# EAGLE design PR5006 (EAGLE 6.5.0)
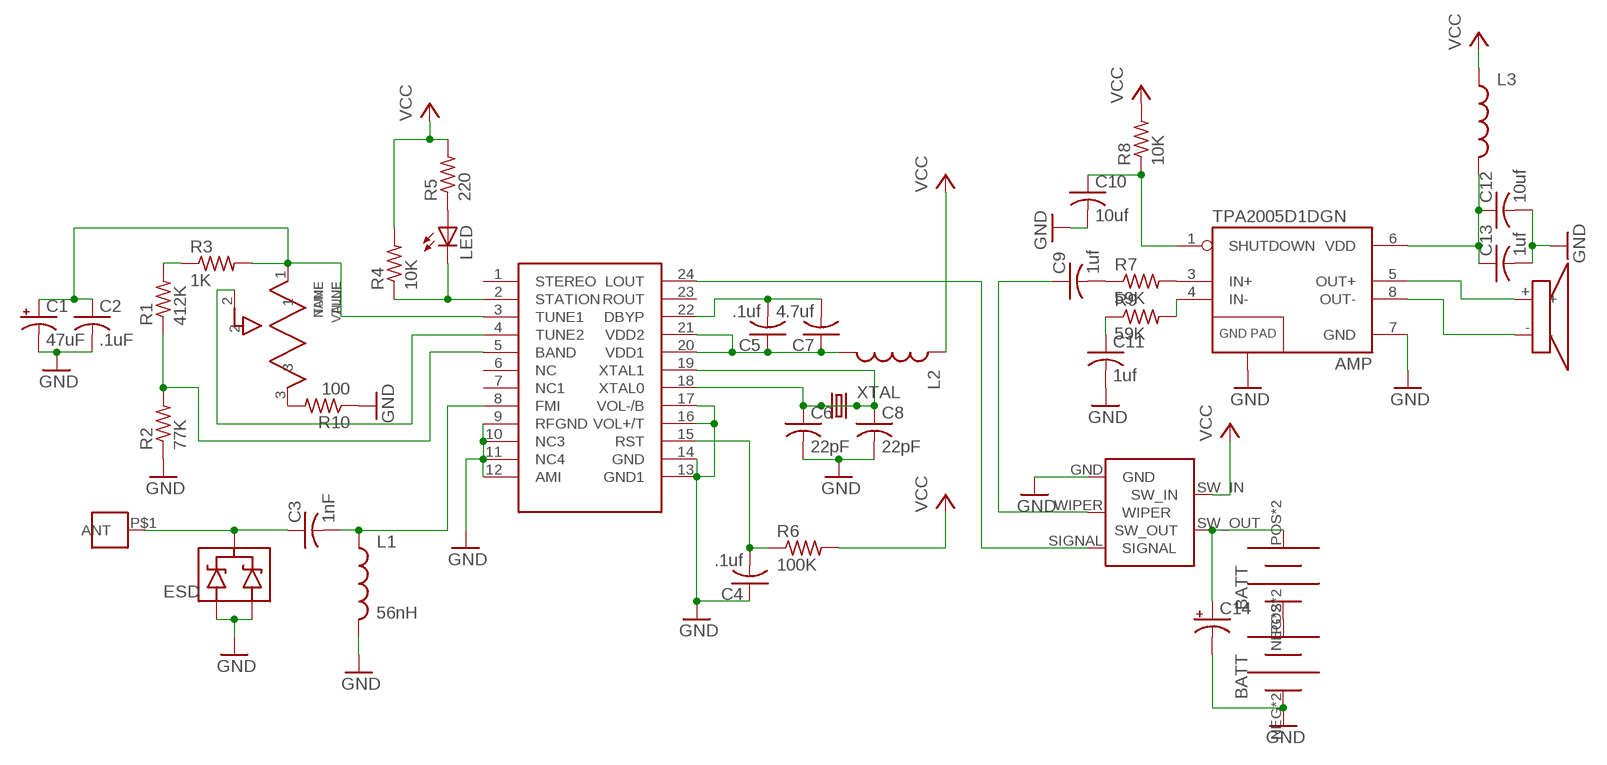
[diagram p0: schematic, sheet 1]

## Parts
AMP  TPA2005D1DGN  [POWER-SOP8]
C1  47uF  CPOL-USE2-5  [E2-5]
C2  .1uF  C-USC0603  [C0603]
C3  1nF  C-USC0603  [C0603]
C4  .1uf  C-USC0603  [C0603]
C5  .1uf  C-USC0603  [C0603]
C6  22pF  C-USC0603  [C0603]
C7  4.7uf  C-USC0603  [C0603]
C8  22pF  C-USC0603  [C0603]
C9  1uf  C-USC0603  [C0603]
C10  10uf  C-USC0603  [C0603]
C11  1uf  C-USC0603  [C0603]
C12  10uf  C-USC0603  [C0603]
C13  1uf  C-USC0603  [C0603]
C14  CPOL-USE2.5-5  [E2,5-5]
ESD  MMBZ27VCLT1  [SOT23-3]
L1  56nH  INDUCTOR0603  [0603]
L2  INDUCTOR0603  [0603]
L3  INDUCTOR0603  [0603]
LED  LEDCHIP-LED0603  [CHIP-LED0603]
R1  412K  R-US_R0603  [R0603]
R2  77K  R-US_R0603  [R0603]
R3  1K  R-US_R0603  [R0603]
R4  10K  R-US_R0603  [R0603]
R5  220  R-US_R0603  [R0603]
R6  100K  R-US_R0603  [R0603]
R7  59K  R-US_R0603  [R0603]
R8  10K  R-US_R0603  [R0603]
R9  59K  R-US_R0603  [R0603]
R10  100  R-US_R0603  [R0603]
SI4831  SI4831-SSOP-24  [SI4831-SSOP-24]
TUNE  TUNE  64XR_BOURNS_TRIMPOT  [64XR_BOURNS_TRIMPOT]
U$1  BK-92_MPD_AA_BATT_CLIP  [BK-92_MPD_AA_BATT_CLIP]
U$2  BK-92_MPD_AA_BATT_CLIP  [BK-92_MPD_AA_BATT_CLIP]
U$3  CE32A_DAYTON_SPKR  [CE32A_DAYTON_SPKR]
U$4  M3_SCREW_POST  [M3_SCREW_POST]
U$5  P170_BOURNS_POT_SW  [P170_BOURNS_POT_SW]
XTAL  CRYSTAL32-SMD  [CRYSTAL-32KHZ-SMD]

## Nets
GND: AMP.7(GND) AMP.9(GND) C1.- C2.2 C4.1 C6.2 C8.2 C10.2 C11.2 C12.2 C13.2 C14.- ESD.1(A1) ESD.2(A2) L1.2 R2.1 R10.1 SI4831.9(RFGND) SI4831.10(NC3) SI4831.11(NC4) SI4831.12(AMI) SI4831.13(GND1) SI4831.14(GND) SI4831.16(VOL+/T) SI4831.17(VOL-/B) U$2.NEG U$2.NEG@2(NEG) U$5.GND
N$1: AMP.3(IN+) R7.2
N$2: AMP.4(IN-) R9.2
N$3: C11.1 R9.1
N$4: C9.2 R7.1
N$5: SI4831.24(LOUT) U$5.SIGNAL
N$6: C5.2 C7.2 SI4831.22(DBYP)
N$7: C8.1 SI4831.19(XTAL1) XTAL.X1
N$8: C4.2 R6.1 SI4831.15(RST)
N$9: LED.C R4.1 SI4831.2(STATION)
N$10: C6.1 SI4831.18(XTAL0) XTAL.X2
N$11: LED.A R5.1
N$12: SI4831.4(TUNE2) TUNE.2
N$13: R1.1 R2.2 SI4831.5(BAND)
N$14: U$1.NEG U$1.NEG@2(NEG) U$2.POS U$2.POS@2(POS)
N$15: C3.2 L1.1 SI4831.8(FMI)
N$16: C5.1 C7.1 L2.2 SI4831.20(VDD1) SI4831.21(VDD2)
N$17: AMP.6(VDD) C12.1 C13.1 L3.2
N$18: AMP.1(SHUTDOWN) C10.1 R8.1
N$19: C3.1 ESD.3(C) U$4.P$1(ANT)
N$20: R1.2 R3.1
N$21: C1.+ C2.1 R3.2 SI4831.3(TUNE1) TUNE.1
N$23: AMP.5(OUT+) U$3.+
N$24: AMP.8(OUT-) U$3.-
N$25: C9.1 U$5.WIPER
N$29: R10.2 TUNE.3
N$32: C14.+ U$1.POS U$1.POS@2(POS) U$5.SW_OUT
VCC: L2.1 L3.1 R4.2 R5.2 R6.2 R8.2 U$5.SW_IN
Unconnected: SI4831.1(STEREO) SI4831.6(NC) SI4831.7(NC1) SI4831.23(ROUT)

## Library data of the parts
AMP = SparkFun-AnalogIC:TPA2005D1: 1.4W MONO CLASS-D AUDIO POWER AMPLIFIER The TPA2005D1 is a 1.4-W high efficiency filter-free class-D audio power amplifier in a BGA, QFN, or MSOP package that requires only three external components. Datasheet: http://focus.ti.com/lit/ds/symlink/tpa2005d1.pdf 1.4 W Into 8 ? From a 5V Supply at THD = 10% (Typ) Maximum Battery Life and Minimum Heat Efficiency With an 8-? Speaker: 84% at 400 mW, 79% at 100 mW 2.8-mA Quiescent Current 0.5-mA Shutdown Current Ideal for Wireless or Cellular Handsets and PDAs Capable of Driving an 8-? Speaker (2.5 V ? VDD ? 5.5 V) and a 4-? Speaker (2.5 V ? VDD ? 4.2 V) Only Three External Components Optimized PWM Output Stage Eliminates LC Output Filter Internally Generated 250-kHz Switching Frequency Eliminates Capacitor and Resistor Improved PSRR (-71 dB at 217 Hz) and Wide Supply Voltage (2.5 V to 5.5 V) Eliminates Need for a Voltage Regulator Fully Differential Design Reduces RF Rectification and Eliminates Bypass Capacitor Improved CMRR Eliminates Two Input Coupling Capacitors
C1 C14 = resistor-copy:CPOL-US: POLARIZED CAPACITOR, American symbol
C2-C13 = resistor:C-US: CAPACITOR, American symbol
ESD = SparkFun-DiscreteSemi:MMBZ27VCLT1: 40W Zener-diode transient voltage suppressor (ESD protection)
L1-L3 = SparkFun-Passives:INDUCTOR: Inductors Basic Inductor/Choke - 0603 and 1206. Footprints are not proven and vary greatly between part numbers. SRN6045- 33uH, 20% 1.4A SDR0403-560KL - 56uH, 10%, 500mA RMS/740mA peak
LED = adafruit:LED: LED OSRAM: - CHIPLED LG R971, LG N971, LY N971, LG Q971, LY Q971, LO R971, LY R971 LH N974, LH R974 LS Q976, LO Q976, LY Q976 LO Q996 - Hyper CHIPLED LW Q18S LB Q993, LB Q99A, LB R99A - SideLED LS A670, LO A670, LY A670, LG A670, LP A670 LB A673, LV A673, LT A673, LW A673 LH A674 LY A675 LS A676, LA A676, LO A676, LY A676, LW A676 LS A679, LY A679, LG A679 - Hyper Micro SIDELED® LS Y876, LA Y876, LO Y876, LY Y876 LT Y87S - SmartLED LW L88C, LW L88S LB L89C, LB L89S, LG L890 LS L89K, LO L89K, LY L89K LS L896, LA L896, LO L896, LY L896 - TOPLED LS T670, LO T670, LY T670, LG T670, LP T670 LSG T670, LSP T670, LSY T670, LOP T670, LYG T670 LG T671, LOG T671, LSG T671 LB T673, LV T673, LT T673, LW T673 LH T674 LS T676, LA T676, LO T676, LY T676, LB T676, LH T676, LSB T676, LW T676 LB T67C, LV T67C, LT T67C, LS T67K, LO T67K, LY T67K, LW E67C LS E67B, LA E67B, LO E67B, LY E67B, LB E67C, LV E67C, LT E67C LW T67C LS T679, LY T679, LG T679 LS T770, LO T770, LY T770, LG T770, LP T770 LB T773, LV T773, LT T773, LW T773 LH T774 LS E675, LA E675, LY E675, LS T675 LS T776, LA T776, LO T776, LY T776, LB T776 LHGB T686 LT T68C, LB T68C - Hyper Mini TOPLED® LB M676 - Mini TOPLED Santana® LG M470 LS M47K, LO M47K, LY M47K Source: http://www.osram.convergy.de/
R1-R10 = resistor:R-US_: RESISTOR, American symbol
SI4831 = PublicRadioICs:SI4831-SSOP-24
TUNE = PR_Libraries:64XR_BOURNS_TRIMPOT: This is a bourns trimpot
U$1 U$2 = PR_Libraries:BK-92_MPD_AA_BATT_CLIP
U$3 = PR_Libraries:CE32A_DAYTON_SPKR
U$4 = PR_Libraries:M3_SCREW_POST
U$5 = PR_Libraries:P170_BOURNS_POT_SW
XTAL = SparkFun-FreqCtrl:CRYSTAL: Various standard crystals. Proven footprints. Spark Fun Electronics SKU : COM-00534; PROD_ID: XTAL-07894

## Board
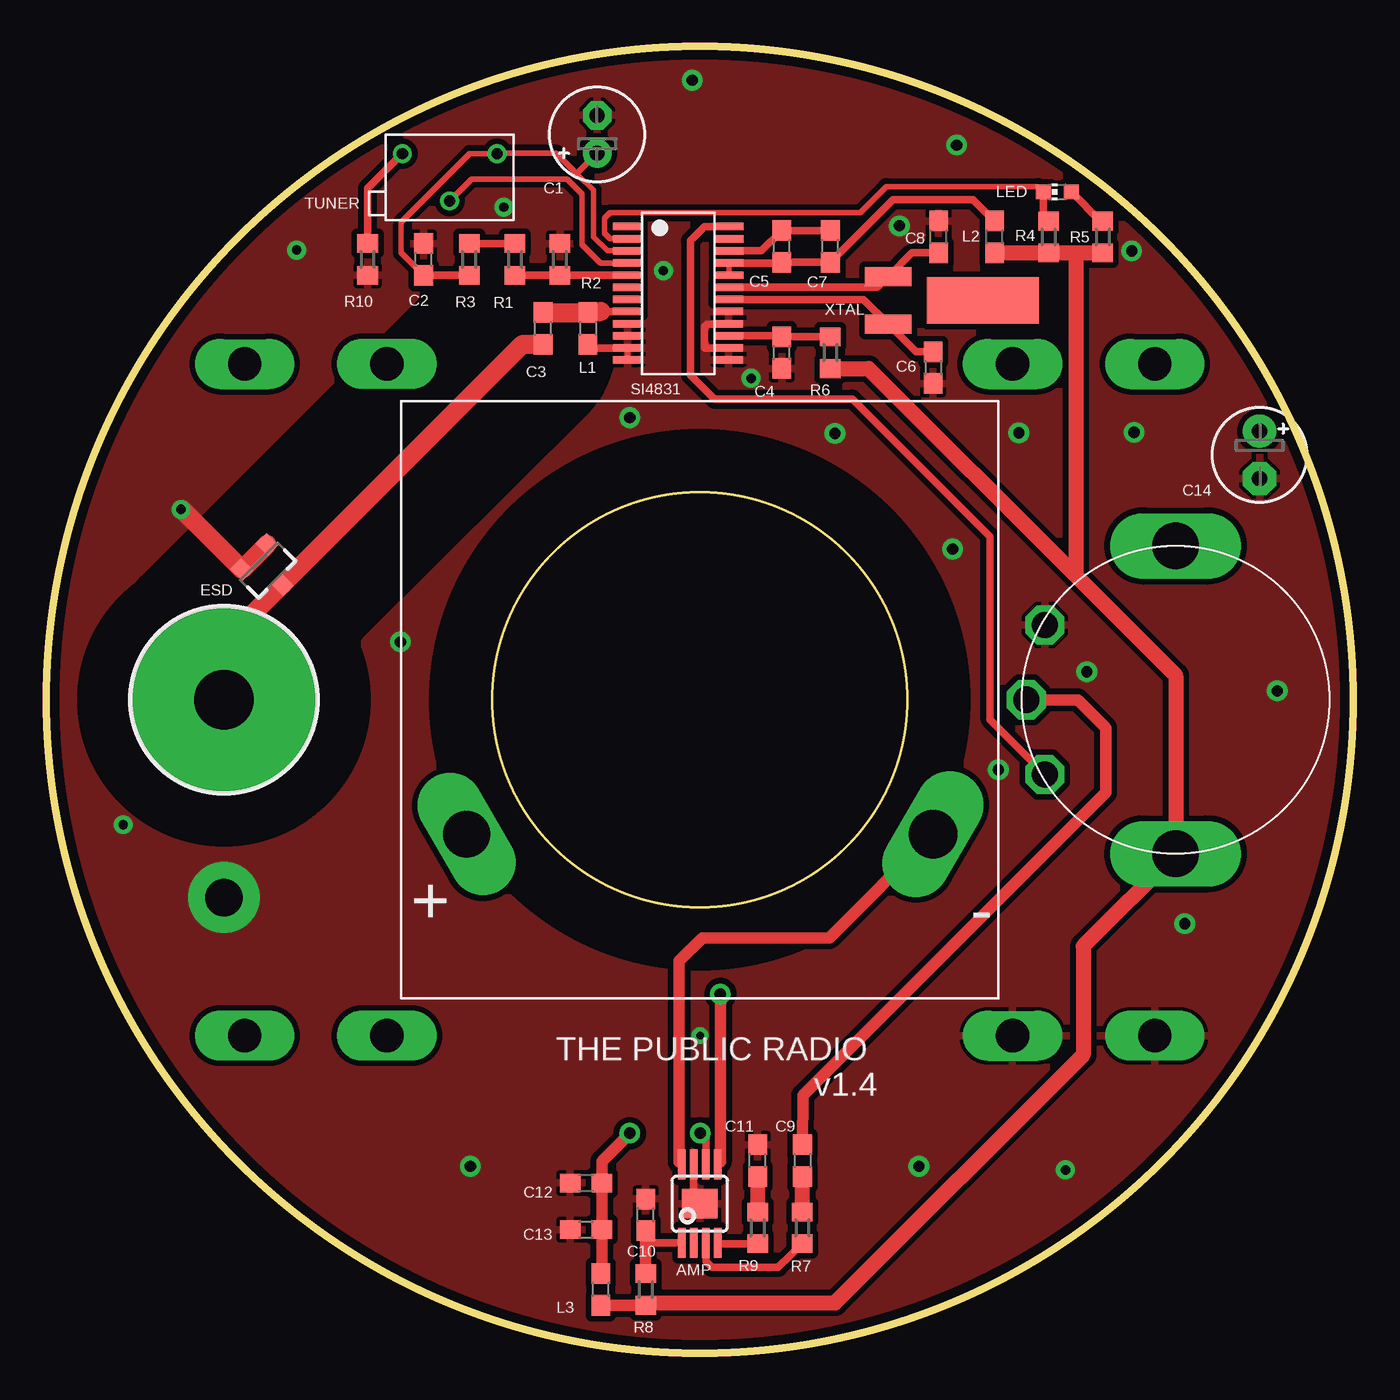
[diagram p1: board, top side]
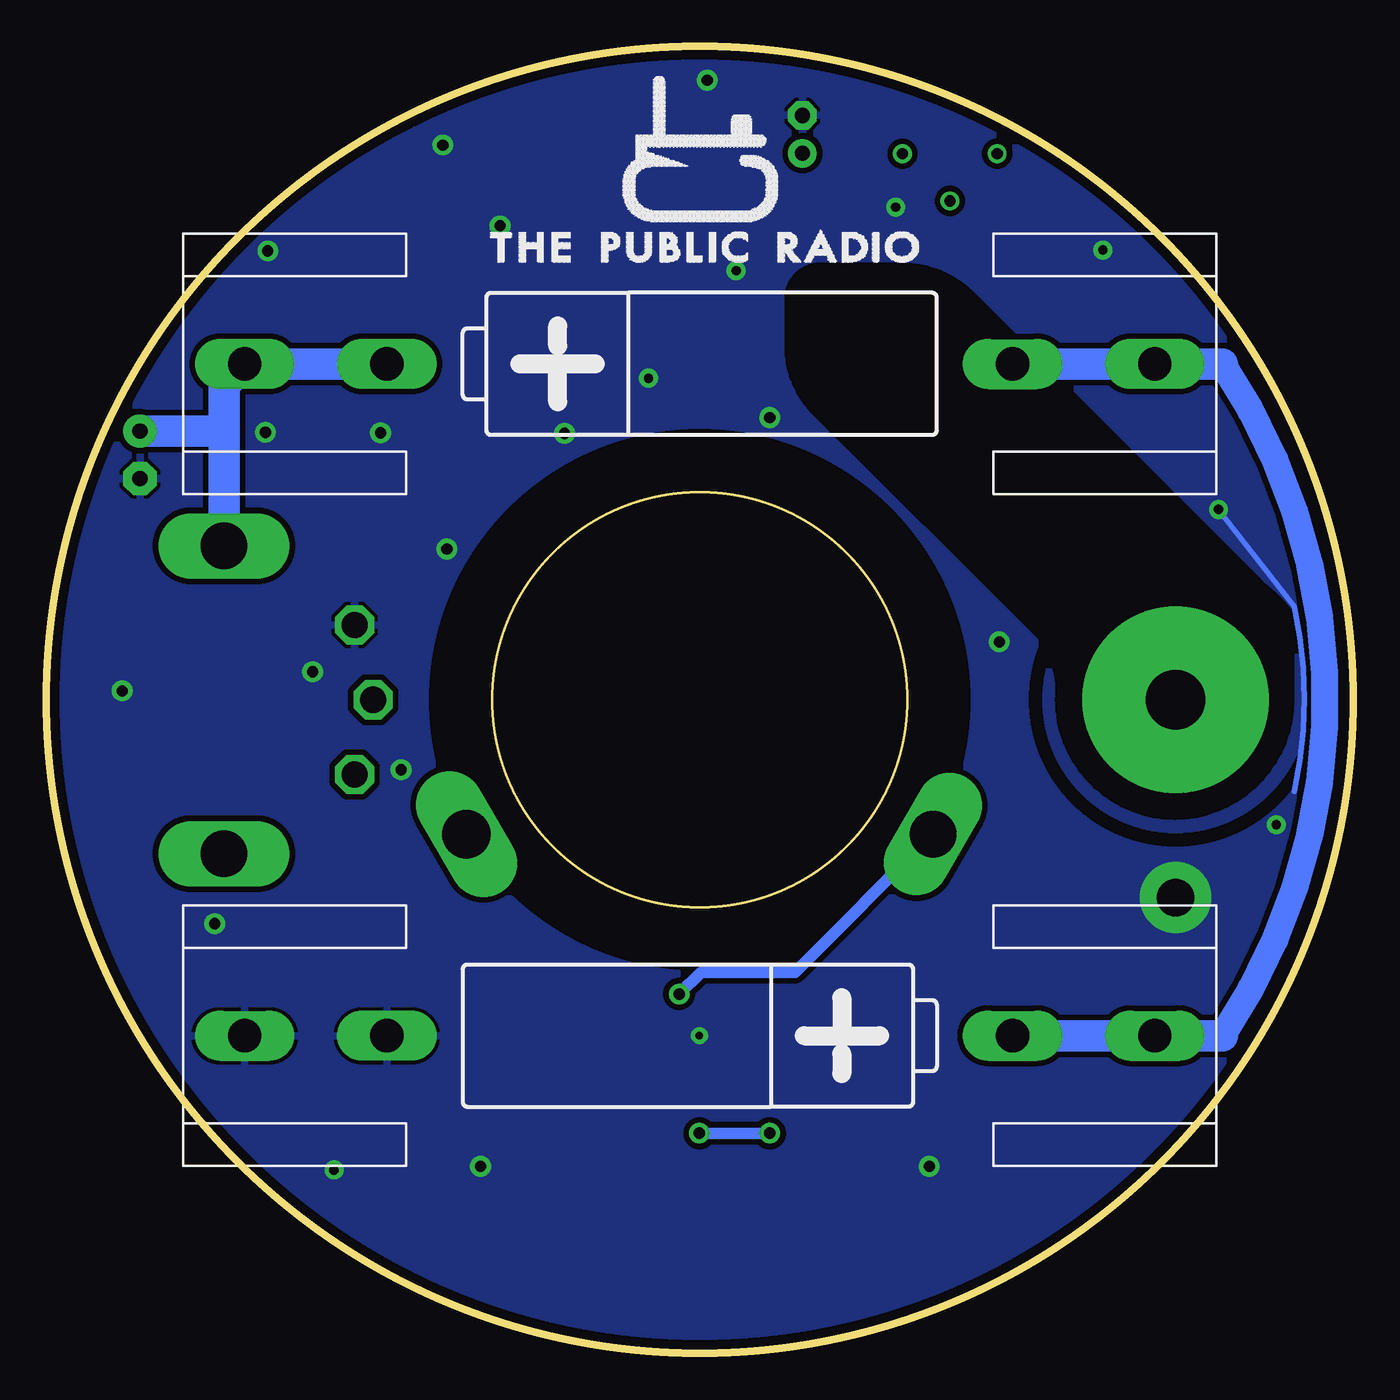
[diagram p2: board, bottom side, seen from below]

Size 70 x 70 mm. Coordinates in mm from the lower left corner, seen from the top.
Outline: circle at 35,35 radius 35
Copper layers (1*16): Top 0.035mm / dielectric 1.5mm / Bottom 0.035mm
Design rules "PCBCart-Standard *": minimum track width 8mil, minimum drill 0.4mm, track to track 8mil, track to pad 8mil, pad to pad 8mil, via to via 8mil, smd to smd 8mil, copper to edge 20mil, drill to drill 8mil, minimum pad ring 8mil, minimum via ring 10mil, stop-mask expansion 3mil, vias tented up to drill 0mil, thermal gap 8mil
tRestrict: area 21,21 to 49,49; area 3.5,29 to 30.1,58
bRestrict: area 21,21 to 49,49; area 3.5,29 to 30.1,58

### Footprints (pad centres in the part's own frame; a part is rotated, then mirrored left to right if it is on the bottom)
POWER-SOP8 = smd 0.4 x 1.6: 1 -0.975,-2.1; 2 -0.325,-2.1; 3 0.325,-2.1; 4 0.975,-2.1; 5 0.975,2.1; 6 0.325,2.1; 7 -0.325,2.1; 8 -0.975,2.1 | smd 1.89 x 1.57: 9 0,0
E2-5 = drill 0.813 pad 1.524: + -1.016,0 | drill 0.813 pad 1.524 octagon: - 1.016,0
C0603 = smd 1.1 x 1: 1 -0.85,0; 2 0.85,0
E2,5-5 = drill 0.813 pad 1.778: + -1.27,0 | drill 0.813 pad 1.778 octagon: - 1.27,0
SOT23-3 = smd 0.8 x 0.9: 1 -0.95,-1; 2 0.95,-1; 3 0,1.1
0603 = smd 1.1 x 1: 1 -0.85,0; 2 0.85,0
CHIP-LED0603 = smd 0.8 x 0.8: A 0,-0.75; C 0,0.75
R0603 = smd 1 x 1.1: 1 -0.85,0; 2 0.85,0
SI4831-SSOP-24 = smd 0.4 x 1.55: 1 -3.575,-2.725; 2 -2.925,-2.725; 3 -2.275,-2.725; 4 -1.625,-2.725; 5 -0.975,-2.725; 6 -0.325,-2.725; 7 0.325,-2.725; 8 0.975,-2.725; 9 1.625,-2.725; 10 2.275,-2.725; 11 2.925,-2.725; 12 3.575,-2.725; 13 3.575,2.7; 14 2.925,2.7; 15 2.275,2.7; 16 1.625,2.7; 17 0.975,2.7; 18 0.325,2.7; 19 -0.325,2.7; 20 -0.975,2.725; 21 -1.625,2.725; 22 -2.275,2.725; 23 -2.925,2.725; 24 -3.575,2.725
64XR_BOURNS_TRIMPOT = drill 0.6: 1 2.54,1.27; 2 0,-1.27; 3 -2.54,1.27
BK-92_MPD_AA_BATT_CLIP = drill 1.778 long: NEG -24.384,0; NEG@2 -16.764,0; POS 16.764,0; POS@2 24.384,0
CE32A_DAYTON_SPKR = drill 2.5 long: + -12.5,-7.2 | drill 2.6 long: - 12.5,-7.2
M3_SCREW_POST = drill 3.2 pad 10: P$1 0,0
P170_BOURNS_POT_SW = drill 1.4 octagon: GND -4,-7; SIGNAL 4,-7; WIPER 0,-8 | drill 2.5 long: SW_IN 8.25,0; SW_OUT -8.25,0
CRYSTAL-32KHZ-SMD = smd 2.5 x 6: SHEILD 0,5.08 | smd 1 x 2.5: X1 -1.27,0; X2 1.27,0

### Placement (x,y rotation side)
AMP  35,8 0 top
C1  29.5,65.3 90 top
C2  20.2,58.6 90 top
C3  26.6,54.9 90 top
C4  39.4,53.6 90 top
C5  39.4,59.3 90 top
C6  47.5,52.8 270 top
C7  42,59.3 90 top
C8  47.8,59.8 90 top
C9  40.5,10.3 270 top
C10  32.1,7.4 90 top
C11  38.1,10.3 90 top
C12  28.9,9.1 180 top
C13  28.9,6.6 180 top
C14  65,48.12 270 top
ESD  11.85,41.94 225 top
L1  29,54.9 270 top
L2  50.8,59.8 90 top
L3  29.7,3.4 90 top
LED  54.16,62.22 90 top
R1  25.1,58.6 90 top
R2  27.5,58.6 270 top
R3  22.64,58.6 270 top
R4  53.7,59.8 270 top
R5  56.6,59.8 270 top
R6  42,53.6 270 top
R7  40.5,6.7 270 top
R8  32.1,3.4 270 top
R9  38.1,6.7 270 top
R10  17.2,58.6 90 top
SI4831  33.85,56.78 270 top
TUNE  21.6,63 0 top
U$1  35,53 180 bottom
U$2  35,17 0 bottom
U$3  35,35 0 top
U$4  9.5,35 0 top
U$5  60.5,35 270 top
XTAL  45.1,56.4 270 top

### Tracks (layer width: path | path; a pad name or v marks a point on that pad's centre or on a via)
GND  (via drill 0.4, 0.5, 0.6, 2 pad 3.81)
  Top 0.305: SI4831.11 SI4831.12
  Top 0.406: AMP.7 34.67,8.32 AMP.9 | SI4831.16 36.52,55.12 35.38,55.12 35.25,55 35.25,53.88 35.27,53.85 SI4831.14 | L1.2 29.2,53.85 SI4831.11
  Top 1.016: ESD.1 ESD.2 7.25,45.2 v7.2,45.2
  Bottom 0.305: 3.15,30.07 arc-25 3.15,40 v7.2,45.2
  other vias: 58.15,59.05 35.02,17 22.7,10 46.75,10 51,31.25 55.75,36.5 33.05,58 37.75,52.23 31.25,50.12 48.77,64.72 42.25,49.27 58.27,49.33 61,23 18.95,38.1 4.1,28.3 54.6,9.8 24.5,61.4 9.5,24.4 45.7,60.4 52.1,49.3 34.6,68.2 13.4,59.1 48.55,43.08 65.95,35.48
  pour Top (isolate 0.305): 35,70 arc-90 70,35 arc-90 35,0 arc-90 0,35 arc-90
  pour Bottom (isolate 0.305): 35,70 arc-90 70,35 arc-100 35,0 arc-90 0,35 arc-90
N$1
  Top 0.406: AMP.3 35.33,4.9 35.65,4.58 39.2,4.58 R7.2
N$2
  Top 0.406: R9.2 35.98,5.85 AMP.4
N$3
  Top 0.813: C11.1 R9.1
N$4
  Top 0.813: R7.1 C9.2
N$5
  Top 0.406: U$5.SIGNAL 50.55,33.95 50.55,43.75 43.17,51.12 43.15,51.1 35.8,51.1 34.5,52.4 34.5,59.6 35.26,60.35 SI4831.24
N$6
  Top 0.406: SI4831.22 38.3,59.05 C5.2 C7.2
N$7
  Top 0.406: SI4831.19 44.53,57.1 XTAL.X1 46.38,58.95 C8.1
N$8
  Top 0.406: SI4831.15 39.34,54.51 C4.2 R6.1
N$9
  Top 0.305: SI4831.2 30.2,59.7 29.9,60 29.9,60.8 30.2,61.1 43.6,61.1 45,62.5 53.12,62.5 LED.C
  Top 0.406: R4.1 53.41,60.94 LED.C
N$10
  Top 0.406: SI4831.18 43.77,56.45 XTAL.X2 46.58,53.65 C6.1
N$11
  Top 0.406: LED.A 56.48,60.65 R5.1
N$12
  Top 0.305: SI4831.4 29.7,58.41 28.7,59.4 28.7,62.1 27.9,62.9 22.77,62.9 TUNE.2
N$13
  Top 0.406: R1.1 R2.2 SI4831.5
N$14
  Bottom 1.45: 7,53 arc68 7,17
  Bottom 1.676: U$2.POS U$2.POS@2 7,17 | 7,53 U$1.NEG U$1.NEG@2
N$15
  Top 0.406: 29.7,55.8 SI4831.8
  Top 1.016: 29.7,55.8 29.05,55.8 L1.1 C3.2
N$16
  Top 0.305: SI4831.20 SI4831.21
  Top 0.406: SI4831.21 39.35,58.41 C5.1 C7.1 45.35,61.8 49.65,61.8 L2.2
N$17  (via drill 0.6)
  Top 0.406: v35.02,11.78 35.33,11.47 AMP.6
  Top 0.61: L3.2 29.75,4.3 C13.1 C12.1 29.75,10.28 v31.25,11.78
  Bottom 0.61: v31.25,11.78 v35.02,11.78
N$18
  Top 0.406: AMP.1 32.1,5.9
  Top 0.61: R8.1 32.1,5.9 C10.1
N$19
  Top 1.016: U$4.P$1 9.5,38.04 ESD.3 25.51,54.05 C3.1
N$20
  Top 0.406: R3.1 R1.2
N$21
  Top 0.305: SI4831.3 30.05,59.05 29.3,59.8 29.3,62.3 28.45,63.15 | 28.45,63.15 27.3,64.3 24.17,64.3 TUNE.1 22.67,64.27 19,60.6 19,58.95 C2.1 | C1.+ 28.45,63.23 28.45,63.15
  Top 0.406: C2.1 R3.2
N$23  (via drill 0.6)
  Top 0.406: 36.1,10.22 AMP.5
  Top 0.61: v36.1,19.23 36.1,10.22
  Bottom 0.61: U$3.+ 29.9,20.4 34.92,20.4 v36.1,19.23
N$24
  Top 0.406: 33.9,10.22 AMP.8
  Top 0.61: U$3.- 41.95,22.25 35.15,22.25 33.9,21 33.9,10.22
N$25
  Top 0.61: C9.1 40.52,13.8 56.75,30.02 56.75,33.5 55.25,35 U$5.WIPER
N$29
  Top 0.406: R10.2 17.2,62.41 TUNE.3
N$32
  Bottom 0.61: 55.58,52.95 55.52,53 | 54.27,52.83 54.45,53
  Bottom 0.813: 60.52,49.52 60.5,49.5
  Bottom 1.676: 60.5,49.2 60.5,49.5 60.5,51.88 U$1.POS@2 55.52,53 54.45,53 U$1.POS | 60.5,49.2 U$5.SW_OUT | C14.+ 60.7,49.4 60.5,49.2
VCC
  Top 0.61: L3.1 R8.2
  Top 0.813: R8.2 32.23,2.67 42.25,2.67 55.55,15.97 55.55,21.8 U$5.SW_IN 60.5,36.3 55.15,41.65 | R6.2 44.05,52.75 55.15,41.65 | L2.1 R4.2 55.15,58.95 | 55.15,58.95 55.15,41.65 | 55.15,58.95 R5.2

### Text on the board
tNames: TUNER | L1 | THE PUBLIC RADIO / v1.4